# Altium schematic sheet WARP_ESC.SchDoc
size A4; SheetNumber: 2; SheetTotal: 5
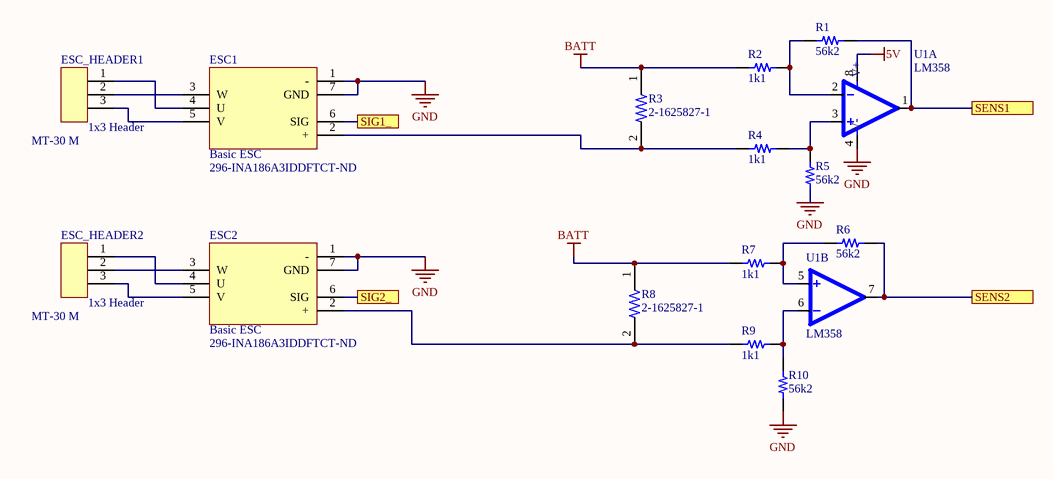
[diagram p0: WARP_ESC.SchDoc]

## Parts
ESC1  Basic ESC  Supplier Part Number 1: 296-INA186A3IDDFTCT-ND  [BLUE ESC TOP]
ESC2  Basic ESC  Supplier Part Number 1: 296-INA186A3IDDFTCT-ND  [BLUE ESC TOP]
ESC_HEADER1  MT-30 M  [MT30-M]
ESC_HEADER2  MT-30 M  [MT30-M]
R1  56k2  [RES 1206_3216]
R2  1k1  [RES 1206_3216]
R3  2-1625827-1  [RESC6331X70N]
R4  1k1  [RES 1206_3216]
R5  56k2  [RES 1206_3216]
R6  56k2  [RES 1206_3216]
R7  1k1  [RES 1206_3216]
R8  2-1625827-1  [RESC6331X70N]
R9  1k1  [RES 1206_3216]
R10  56k2  [RES 1206_3216]
U1  LM358  [LM358]  (parts A,B of 2)

## Ports
SENS1, SENS2, SIG1_, SIG2_

## Nets
5V: U1.8(V+)
BATT: R2.1 R3.1 R7.1 R8.1
GND: ESC1.1(-) ESC1.7(GND) ESC2.1(-) ESC2.7(GND) R5.1 R10.1 U1.4(V-)
SENS1: R1.2 U1.1(OUT) ; port SENS1
SENS2: R6.2 U1.7(OUT) ; port SENS2
SIG1_: ESC1.6(SIG) ; port SIG1_
SIG2_: ESC2.6(SIG) ; port SIG2_
NetESC1_2: ESC1.2(+) R3.2 R4.1
NetESC1_3: ESC1.3(W) ESC_HEADER1.2
NetESC1_4: ESC1.4(U) ESC_HEADER1.1
NetESC1_5: ESC1.5(V) ESC_HEADER1.3
NetESC2_2: ESC2.2(+) R8.2 R9.1
NetESC2_3: ESC2.3(W) ESC_HEADER2.2
NetESC2_4: ESC2.4(U) ESC_HEADER2.1
NetESC2_5: ESC2.5(V) ESC_HEADER2.3
NetR1_1: R1.1 R2.2 U1.2(-IN)
NetR4_2: R4.2 R5.2 U1.3(+IN)
NetR6_1: R6.1 R7.2 U1.5(+IN)
NetR9_2: R9.2 R10.2 U1.6(-IN)

## Notes on the sheet
- (in symbol MT-30 M) 1x3 Header

## Library data of the parts
ESC1 ESC2 = Basic ESC: 40V, bi-directional, high-precision current sense amplifier w/ picoamp IB & ENABLE 8-SOT-23-THIN -40 to 125; Manufacturer: Texas Instruments; Manufacturer Part Number: INA186A3IDDFT; Supplier 1: Digi-Key; RoHS: Yes; Category: Amplifiers - Op Amps, Buffer, Instrumentation; Stock 1: 525; Pricing 1: 1=1,75000, 10=1,57300, 25=1,48400, 100=1,26440 (USD)
R1 R2 R4-R7 R9 R10 = RL1206FR-7W0R1L: RES 0.1 OHM 1% 1/2W 1206; Manufacturer: Yageo; Power (Watts): 0.5W, 1/2W; Resistance: 100 mOhms; Temperature Coefficient: ±600ppm/°C; Value: 100 mOhms; Part Number: RL1206FR-7W0R1L; ComponentLink1Description: Datasheet; ComponentLink1URL: http://www.yageo.com/documents/recent/PYu-RL_Group_521_RoHS_L_2.pdf; ComponentLink2Description: DigiKey Link; ComponentLink2URL: https://www.digikey.com/en/products/detail/yageo/RL1206FR-7W0R1L/2827682; Composition: Thick Film; Device Package: 1206 (3216 Metric); Features: Automotive AEC-Q200, Current Sense, Moisture Resistant; Height - Seated (Max): 0.026" (0.65mm); LastUpdated: 22.06.2022 13:26:42; Lifecycle Status: Active; Minimum Order: 1; Number of Terminations: 2; Operating Temperature: -55°C ~ 125°C; Package / Case: 1206 (3216 Metric); Packaging: TapeAndReel; PartId: 26837; Part Status: Active; Price: 0.10; Ratings: AEC-Q200; Series: RL; Size / Dimension: 0.122" L x 0.063" W (3.10mm x 1.60mm); Supplier 1: DigiKey; Supplier Part Number 1: 311-0.1LYCT-ND; Supplier Device Package: 1206; Tolerance: ±1%
R3 R8 = 2-1625827-1: TL3A R002 1% 2K RL; Package: None; Price: None; Value: *; MP: 2-1625827-1; Availability: Unavailable